# EAGLE design pcb (EAGLE 9.4.2)
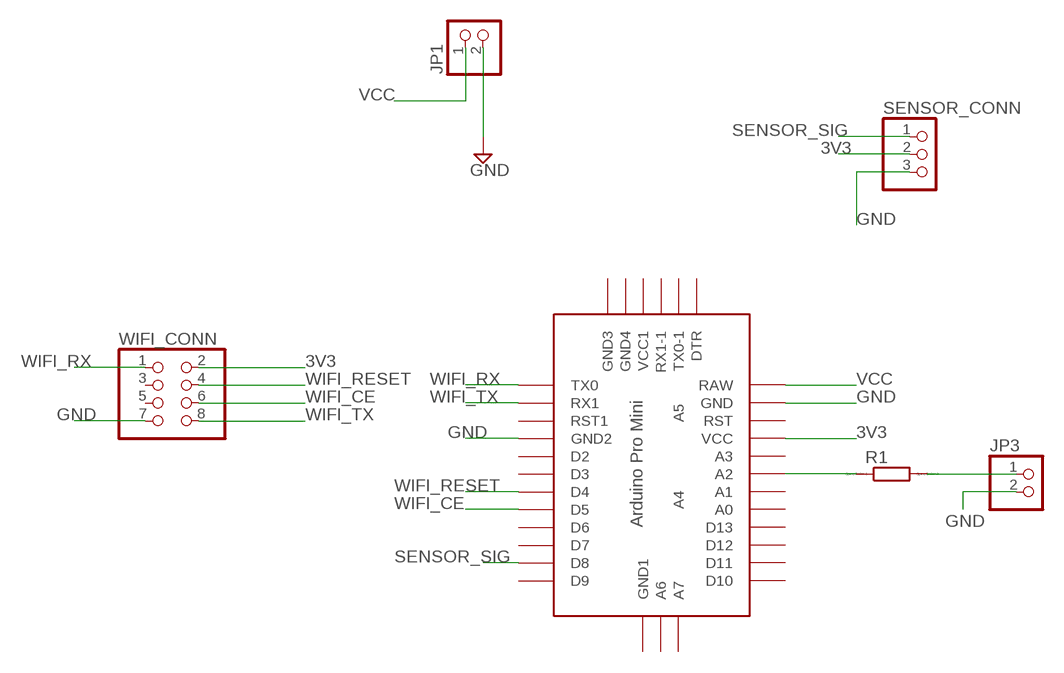
[diagram p0: schematic, sheet 1]

## Parts
JP1  PINHD-1X2  [1X02]
JP3  PINHD-1X2  [1X02]
R1  R0207/10  [0207/10]
SENSOR_CONN  PINHD-1X3  [1X03]
U$1  ABK-PRO-MINI  [ABK-PRO-MINI]
WIFI_CONN  PINHD-2X4  [2X04]

## Nets
3V3: SENSOR_CONN.2 U$1.VCC WIFI_CONN.2
GND: JP1.2 JP3.2 SENSOR_CONN.3 U$1.GND U$1.GND1(GND2) WIFI_CONN.7
N$7: JP3.1 R1.2
N$8: R1.1 U$1.A2
SENSOR_SIG: SENSOR_CONN.1 U$1.D8
VCC: JP1.1 U$1.RAW
WIFI_CE: U$1.D5 WIFI_CONN.6
WIFI_RESET: U$1.D4 WIFI_CONN.4
WIFI_RX: U$1.TX0 WIFI_CONN.1
WIFI_TX: U$1.RX1 WIFI_CONN.8
Unconnected: U$1.A0 U$1.A1 U$1.A3 U$1.A4 U$1.A5 U$1.A6 U$1.A7 U$1.D2 U$1.D3 U$1.D6 U$1.D7 U$1.D9 U$1.D10 U$1.D11 U$1.D12 U$1.D13 U$1.DTR U$1.GND2(GND3) U$1.GND3(GND4) U$1.GND4(GND1) U$1.RST U$1.RST1 U$1.RX1-1 U$1.TX0-1 U$1.VCC1 WIFI_CONN.3 WIFI_CONN.5

## Library data of the parts
JP1 JP3 = pinhead:PINHD-1X2: PIN HEADER
R1 = eagle-ltspice:R: RESISTOR, European symbol; SPICEMODEL: NONE; SPICEPREFIX: R
SENSOR_CONN = pinhead:PINHD-1X3: PIN HEADER
U$1 = Arduino-clone:ABK-PRO-MINI: ABK Pro-Mini Arduino Clone
WIFI_CONN = pinhead:PINHD-2X4: PIN HEADER

## Board
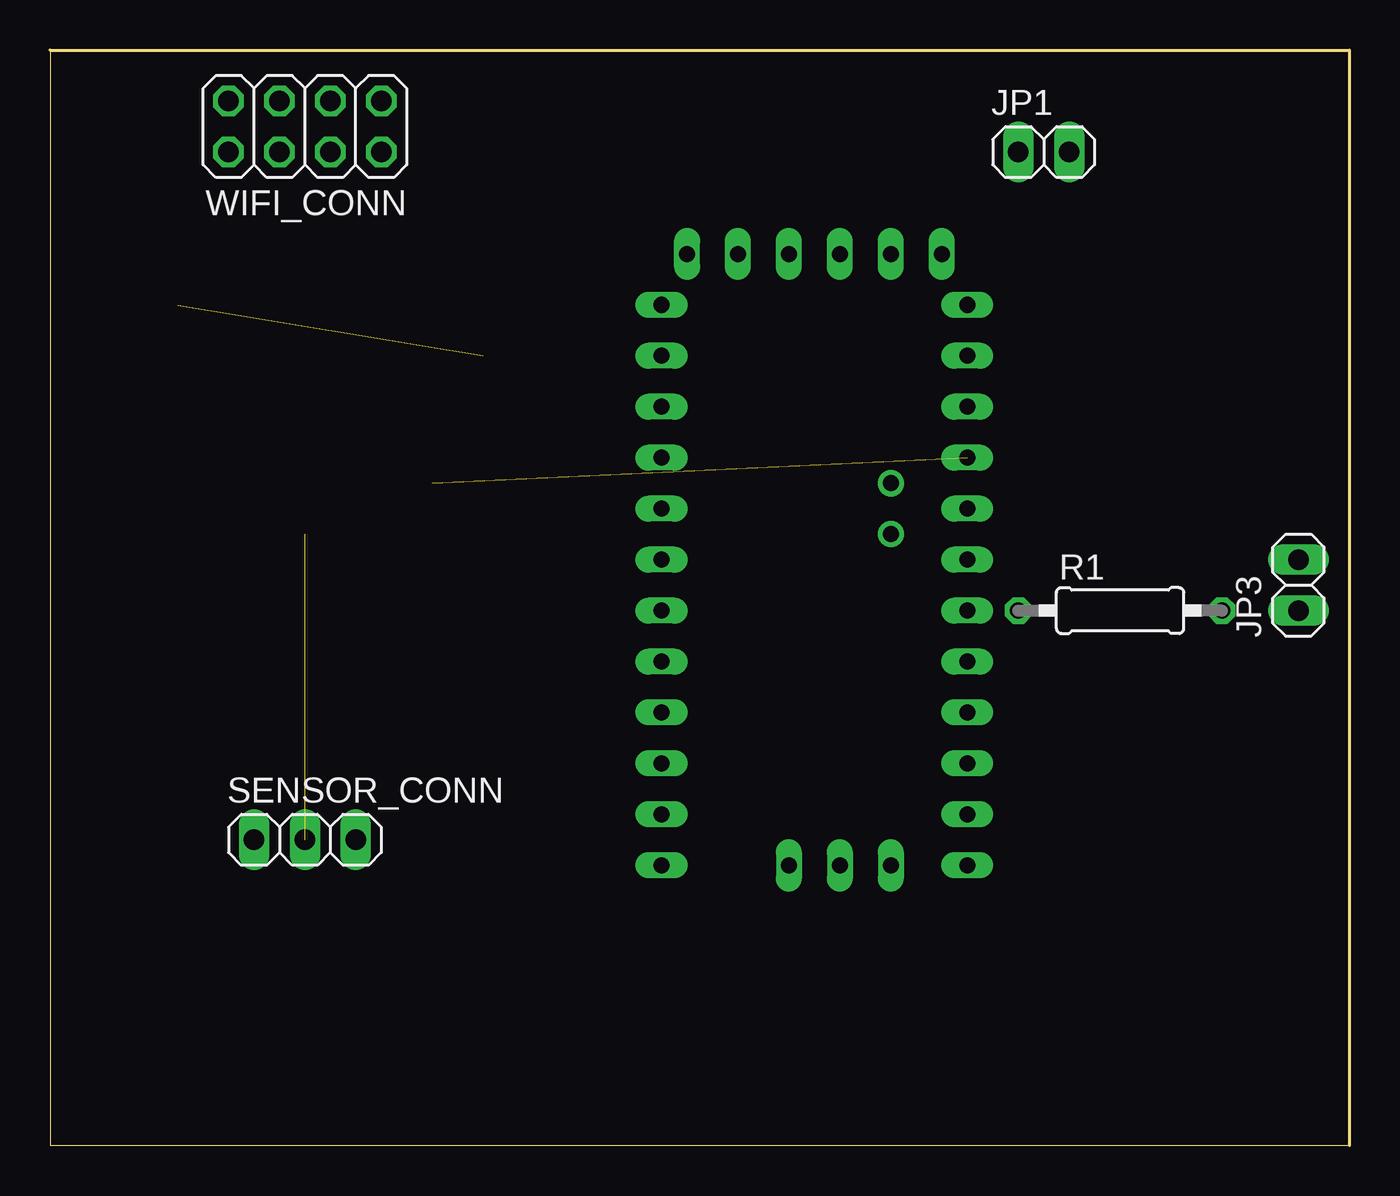
[diagram p1: board, top side]
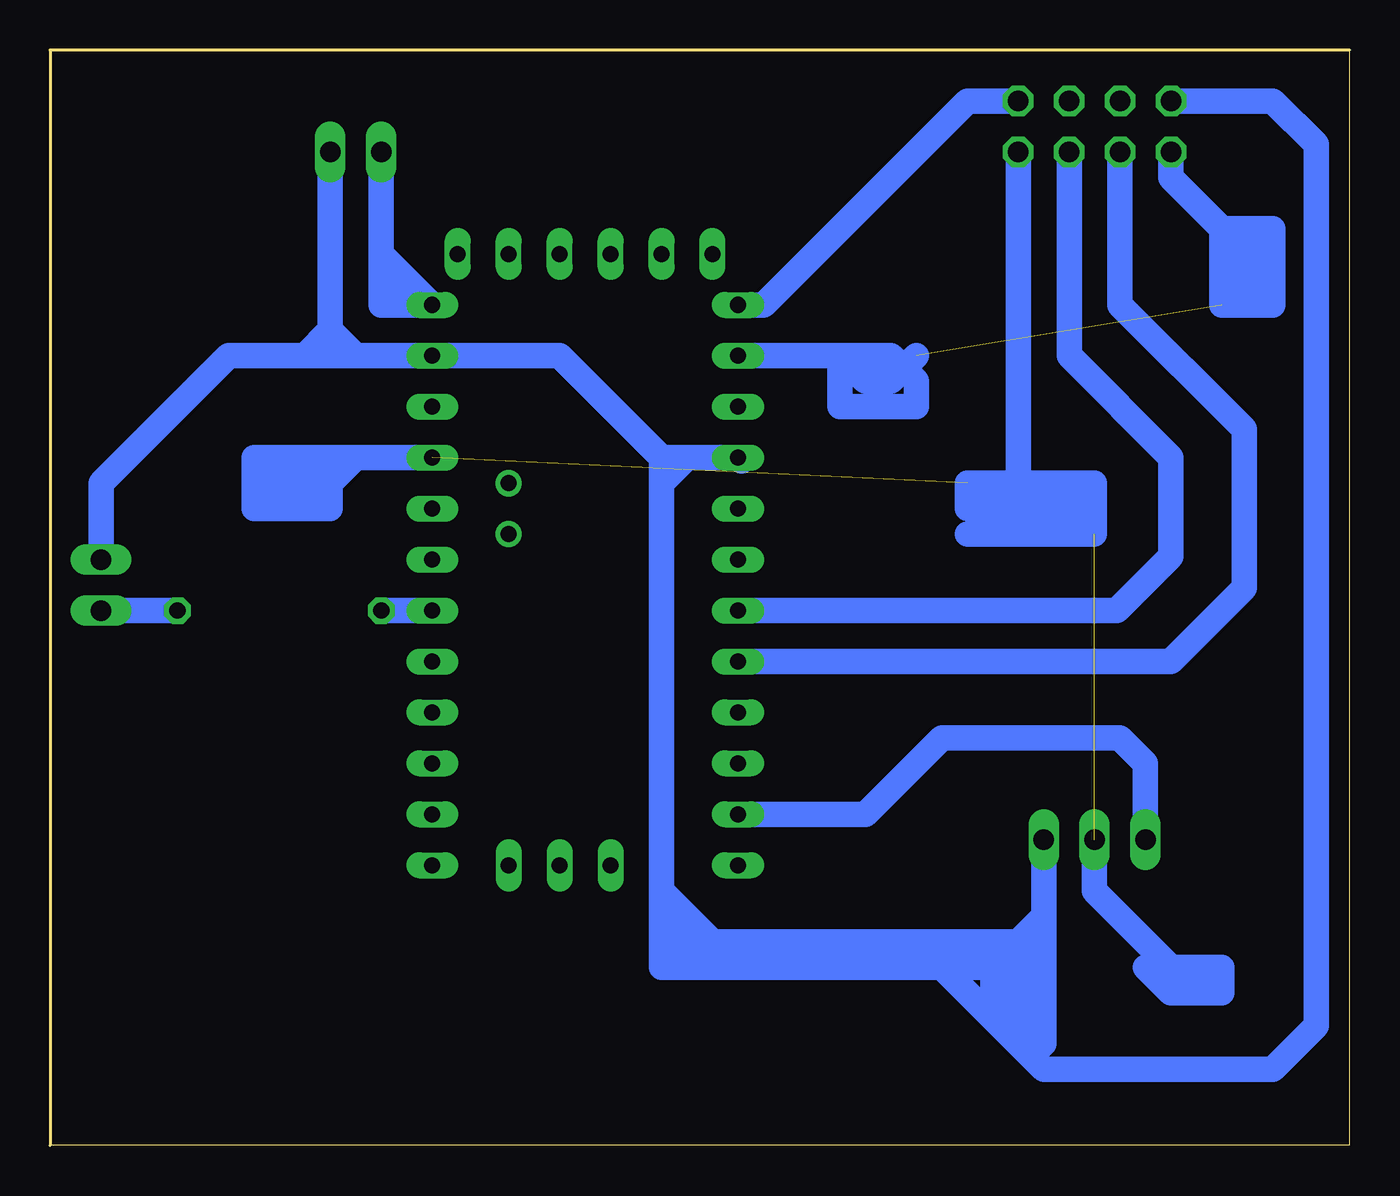
[diagram p2: board, bottom side, seen from below]

Size 64.77 x 54.61 mm. Coordinates in mm from the lower left corner, seen from the top.
Outline: 0,0 64.77,0 64.77,54.61 0,54.61 0,0
Copper layers (1*16): Top 0.035mm / dielectric 1.5mm / Bottom 0.035mm
Design rules "default": minimum track width 6mil, minimum drill 0.35mm, track to track 6mil, track to pad 6mil, pad to pad 6mil, via to via 6mil, smd to smd 6mil, copper to edge 40mil, drill to drill 6mil, minimum pad ring 10mil, minimum via ring 8mil, stop-mask expansion 4mil, vias tented up to drill 0mil, thermal gap 10mil

### Footprints (pad centres in the part's own frame; a part is rotated, then mirrored left to right if it is on the bottom)
1X02 = drill 1.016 long: 1 -1.27,0; 2 1.27,0
0207/10 = drill 0.813 octagon: 1 -5.08,0; 2 5.08,0
1X03 = drill 1.016 long: 1 -2.54,0; 2 0,0; 3 2.54,0
ABK-PRO-MINI = drill 0.8 long: A0 10.16,-3.81; A1 10.16,-6.35; A2 10.16,-8.89; A3 10.16,-11.43; A6 3.81,-21.59; A7 6.35,-21.59; D2 -5.08,-3.81; D3 -5.08,-6.35; D4 -5.08,-8.89; D5 -5.08,-11.43; D6 -5.08,-13.97; D7 -5.08,-16.51; D8 -5.08,-19.05; D9 -5.08,-21.59; D10 10.16,-21.59; D11 10.16,-19.05; D12 10.16,-16.51; D13 10.16,-13.97; DTR 8.89,8.89; GND 10.16,3.81; GND1 -5.08,-1.27; GND2 -3.81,8.89; GND3 -1.27,8.89; GND4 1.27,-21.59; RAW 10.16,6.35; RST 10.16,1.27; RST1 -5.08,1.27; RX1 -5.08,3.81; RX1-1 3.81,8.89; TX0 -5.08,6.35; TX0-1 6.35,8.89; VCC 10.16,-1.27; VCC1 1.27,8.89 | drill 0.8: A4 6.35,-5.08; A5 6.35,-2.54
2X04 = drill 1.016 octagon: 1 -3.81,-1.27; 2 -3.81,1.27; 3 -1.27,-1.27; 4 -1.27,1.27; 5 1.27,-1.27; 6 1.27,1.27; 7 3.81,-1.27; 8 3.81,1.27

### Placement (x,y rotation side)
JP1  49.53,49.53 0 top
JP3  62.23,27.94 90 top
R1  53.34,26.67 0 top
SENSOR_CONN  12.7,15.24 0 top
U$1  35.56,35.56 0 top
WIFI_CONN  12.7,50.8 180 top

### Tracks (layer width: path | path; a pad name or v marks a point on that pad's centre or on a via)
3V3  (2 unrouted)
  Bottom 1.27: SENSOR_CONN.2 12.7,12.7 8.89,8.89 6.35,8.89 6.35,7.62 8.89,7.62 10.16,8.89 | U$1.VCC 49.53,34.29 | 54.61,33.02 54.61,34.29 49.53,34.29 | 50.8,33.02 54.61,33.02 | 54.61,33.02 54.61,31.75 50.8,31.75 50.8,33.02 | 49.53,34.29 50.8,33.02 | 16.51,33.02 12.7,33.02 12.7,31.75 | 12.7,31.75 19.05,31.75 19.05,33.02 16.51,33.02 | WIFI_CONN.2 16.51,33.02 | 12.7,31.75 12.7,30.48 19.05,30.48
GND
  Bottom 1.27: 49.53,39.37 U$1.GND 39.37,39.37 34.29,34.29 | 50.8,40.64 JP1.2 | 50.8,40.64 49.53,39.37 | 49.53,39.37 50.8,39.37 | 50.8,39.37 50.8,40.64 | JP3.2 62.23,33.02 55.88,39.37 52.07,39.37 | 52.07,39.37 50.8,39.37 | 52.07,39.37 50.8,40.64 | 33.02,34.29 U$1.GND1 30.31,34.12 | 33.02,34.29 34.29,34.29 | SENSOR_CONN.3 15.24,11.43 | 15.24,11.43 16.51,10.16 | 34.29,33.02 34.29,34.29 | 33.02,34.29 34.29,33.02 | 34.29,33.02 34.29,12.7 | 31.75,10.16 33.02,11.43 | 33.02,11.43 34.29,12.7 | 34.29,10.16 31.75,10.16 | 34.29,12.7 34.29,10.16 | 33.02,11.43 34.29,10.16 | 31.75,10.16 16.51,10.16 | 16.51,10.16 16.51,8.89 | 17.78,8.89 16.51,8.89 | 17.78,8.89 20.32,8.89 | 20.32,8.89 34.29,8.89 34.29,10.16 | 16.51,8.89 15.24,10.16 | 15.24,11.43 15.24,10.16 | 17.78,8.89 17.78,6.35 | 17.78,6.35 16.51,5.08 | 16.51,5.08 15.88,4.45 | 15.88,4.45 15.24,3.81 3.81,3.81 1.65,5.97 1.65,49.91 3.81,52.07 WIFI_CONN.7 | 15.24,10.16 15.24,5.08 15.88,4.45 | 16.51,8.89 16.51,5.08 | 17.78,6.35 20.32,8.89
N$7
  Bottom 1.27: R1.2 JP3.1
N$8
  Bottom 1.27: U$1.A2 R1.1
SENSOR_SIG
  Bottom 1.27: SENSOR_CONN.1 10.16,19.05 11.43,20.32 20.32,20.32 24.13,16.51 U$1.D8
VCC
  Bottom 1.27: 48.26,41.91 48.26,44.45 | 48.26,44.45 JP1.1 | U$1.RAW 46.99,43.18 | 48.26,41.91 46.99,43.18 | U$1.RAW 46.99,41.91 | 46.99,43.18 48.26,44.45 | U$1.RAW 48.26,41.91
WIFI_CE
  Bottom 1.27: U$1.D5 8.89,24.13 5.23,27.79 5.23,35.71 11.43,41.91 WIFI_CONN.6
WIFI_RESET
  Bottom 1.27: U$1.D4 11.58,26.67 8.89,29.36 8.89,34.29 13.97,39.37 WIFI_CONN.4
WIFI_RX
  Bottom 1.27: U$1.TX0 29.21,41.91 19.05,52.07 WIFI_CONN.1
WIFI_TX  (1 unrouted)
  Bottom 1.27: WIFI_CONN.8 8.89,48.26 6.35,45.72 | 5.08,45.72 3.81,45.72 3.81,41.91 5.08,41.91 | 5.08,41.91 6.35,41.91 6.35,45.72 | 5.08,45.72 6.35,45.72 | 5.08,41.91 5.08,45.72 | 25.4,39.37 22.86,39.37 21.59,38.1 21.59,36.83 25.4,36.83 25.4,39.37 | 25.4,39.37 24.13,38.1 22.86,38.1 21.59,39.37 | U$1.RX1 25.4,39.37